# EAGLE design IR_Emitter (EAGLE 7.4.0)
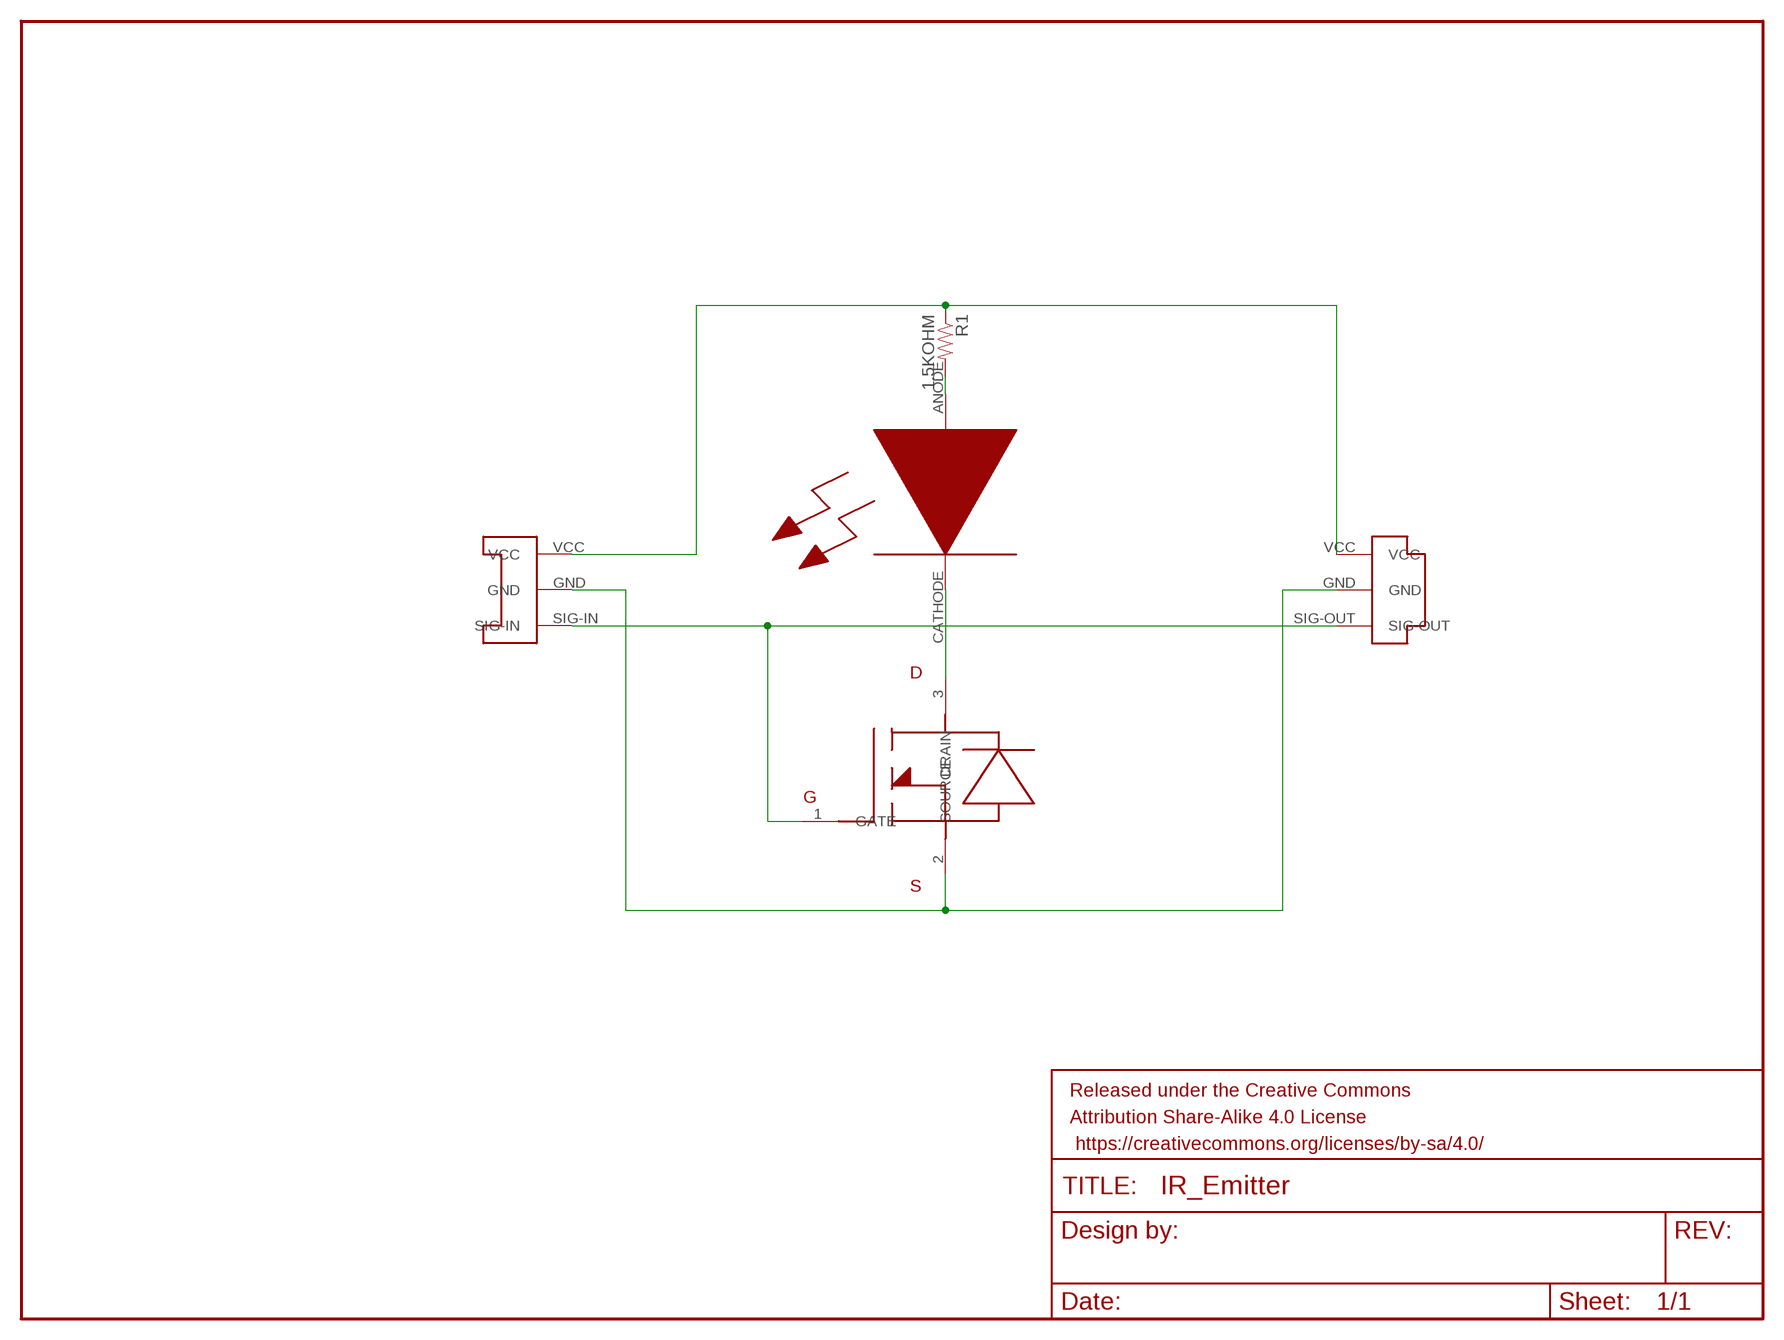
[diagram p0: schematic, sheet 1]

## Parts
FRAME1  FRAME-LETTERNO_PACKAGE  [DUMMY]
R1  1.5KOHM  1.5KOHM-1/10W-1%(0603)  [0603]
U$1  CONN-PLUG-3POS-3MM  [PLUG-3POS-3MM-SMD]
U$2  CONN-SOCKET-3POS-3MM  [SOCKET-3POS-3MM-SMD]
U$3  MOSFET-N-CHAN  [SOT23-3]
U$4  IR-EMITTER-VSMB2943G  [VEMD2020X01]

## Nets
GND: U$1.GND U$2.GND U$3.2(SOURCE)
N$4: R1.2 U$4.ANODE
N$6: U$3.3(DRAIN) U$4.CATHODE
SIG: U$1.SIG-OUT U$2.SIG-IN U$3.1(GATE)
VCC: R1.1 U$1.VCC U$2.VCC

## Library data of the parts
FRAME1 = SparkFun-Aesthetics:FRAME-LETTER: Schematic Frame Standard 8.5x11 US Letter frame; DESIGNER: Nobody; VERSION: v01
R1 = SparkFun-Resistors:1.5KOHM-1/10W-1%(0603): RES-08306; PROD_ID: RES-08306
U$1 = EmbeddedPlayground:CONN-PLUG-3POS-3MM: Surface mount board to board connector. Female socket, 3 position.
U$2 = EmbeddedPlayground:CONN-SOCKET-3POS-3MM: Surface mount board to board connector. Female socket, 3 position.
U$3 = EmbeddedPlayground:MOSFET-N-CHAN
U$4 = EmbeddedPlayground:IR-EMITTER-VSMB2943G

## Board
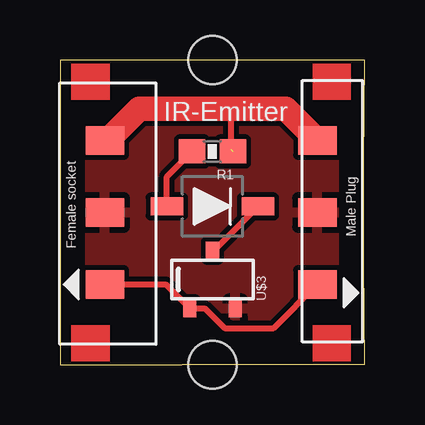
[diagram p1: board, top side]
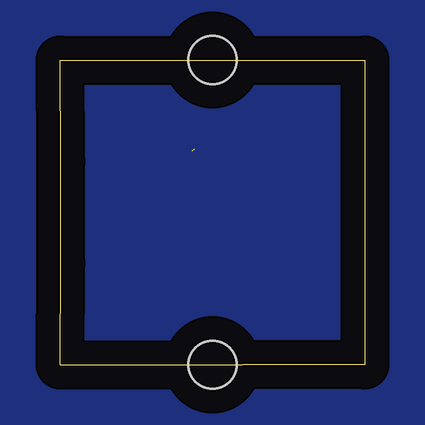
[diagram p2: board, bottom side, seen from below]

Size 12.7 x 12.7 mm. Coordinates in mm from the lower left corner, seen from the top.
Outline: 5.08,0 0,0 0,12.7 5.08,12.7
Outline: 5.1,12.7 12.7,12.7 arc2 12.7,0 5.1,0
Copper layers (1*16): Top 0.035mm / dielectric 1.5mm / Bottom 0.035mm
Design rules "default": minimum track width 10mil, minimum drill 24mil, track to track 8mil, track to pad 8mil, pad to pad 8mil, via to via 8mil, smd to smd 8mil, copper to edge 40mil, drill to drill 8mil, minimum pad ring 10mil, minimum via ring 8mil, stop-mask expansion 4mil, vias tented up to drill 0mil, thermal gap 10mil
Holes 2 mm at 6.35,12.7 6.35,0

### Footprints (pad centres in the part's own frame; a part is rotated, then mirrored left to right if it is on the bottom)
0603 = smd 1.1 x 1: 1 -0.85,0; 2 0.85,0
PLUG-3POS-3MM-SMD = smd 1.2 x 1.6: GND 0,0; SIG-OUT 3,0; VCC -3,0
SOCKET-3POS-3MM-SMD = smd 1.2 x 1.6: GND 0,0; SIG-IN -3,0; VCC 3,0
SOT23-3 = smd 0.55 x 0.75: 1 -0.95,-1.2; 2 0.95,-1.2; 3 0,1.2
VEMD2020X01 = smd 1.35 x 0.75: ANODE 1.9,0; CATHODE -1.9,0

### Placement (x,y rotation side)
FRAME1  0,0 0 top
R1  6.35,8.89 180 top
U$1  10.72,6.35 270 top
U$2  1.87,6.35 90 top
U$3  6.35,3.56 0 top
U$4  6.35,6.6 180 top

### Tracks (layer width: path | path; a pad name or v marks a point on that pad's centre or on a via)
GND
  pour Top: -2.54,15.24 -2.54,-2.54 15.24,-2.54 15.24,15.24
  pour Bottom: -2.54,15.24 15.24,15.24 15.24,-2.54 -2.54,-2.54
N$4
  Top 0.254: U$4.ANODE 4.45,7.84 R1.2
N$6
  Top 0.254: U$3.3 6.4,4.76 U$4.CATHODE
SIG
  Top 0.254: U$2.SIG-IN 4.41,3.35 U$3.1 6.03,2.36 6.86,1.52 8.9,1.52 U$1.SIG-OUT
VCC  (1 unrouted)
  Top 0.254: 7.11,10.67 7.11,8.98
  Top 1.016: U$2.VCC 1.98,9.35 3.3,10.67 7.11,10.67 9.41,10.67 U$1.VCC

### Text on the board
tPlace: IR-Emitter